# Altium schematic sheet Pallette v2.SchDoc: Pallette - Tongue Controlled Interface
size A3; Author: Joanna Zhang; Organization: Cornell Tech; Address1: 111 8th Ave #302; Address2: New York, NY; Address3: 10011; Revision: 2; SheetNumber: 1; SheetTotal: 1; ProjectName: Pallette
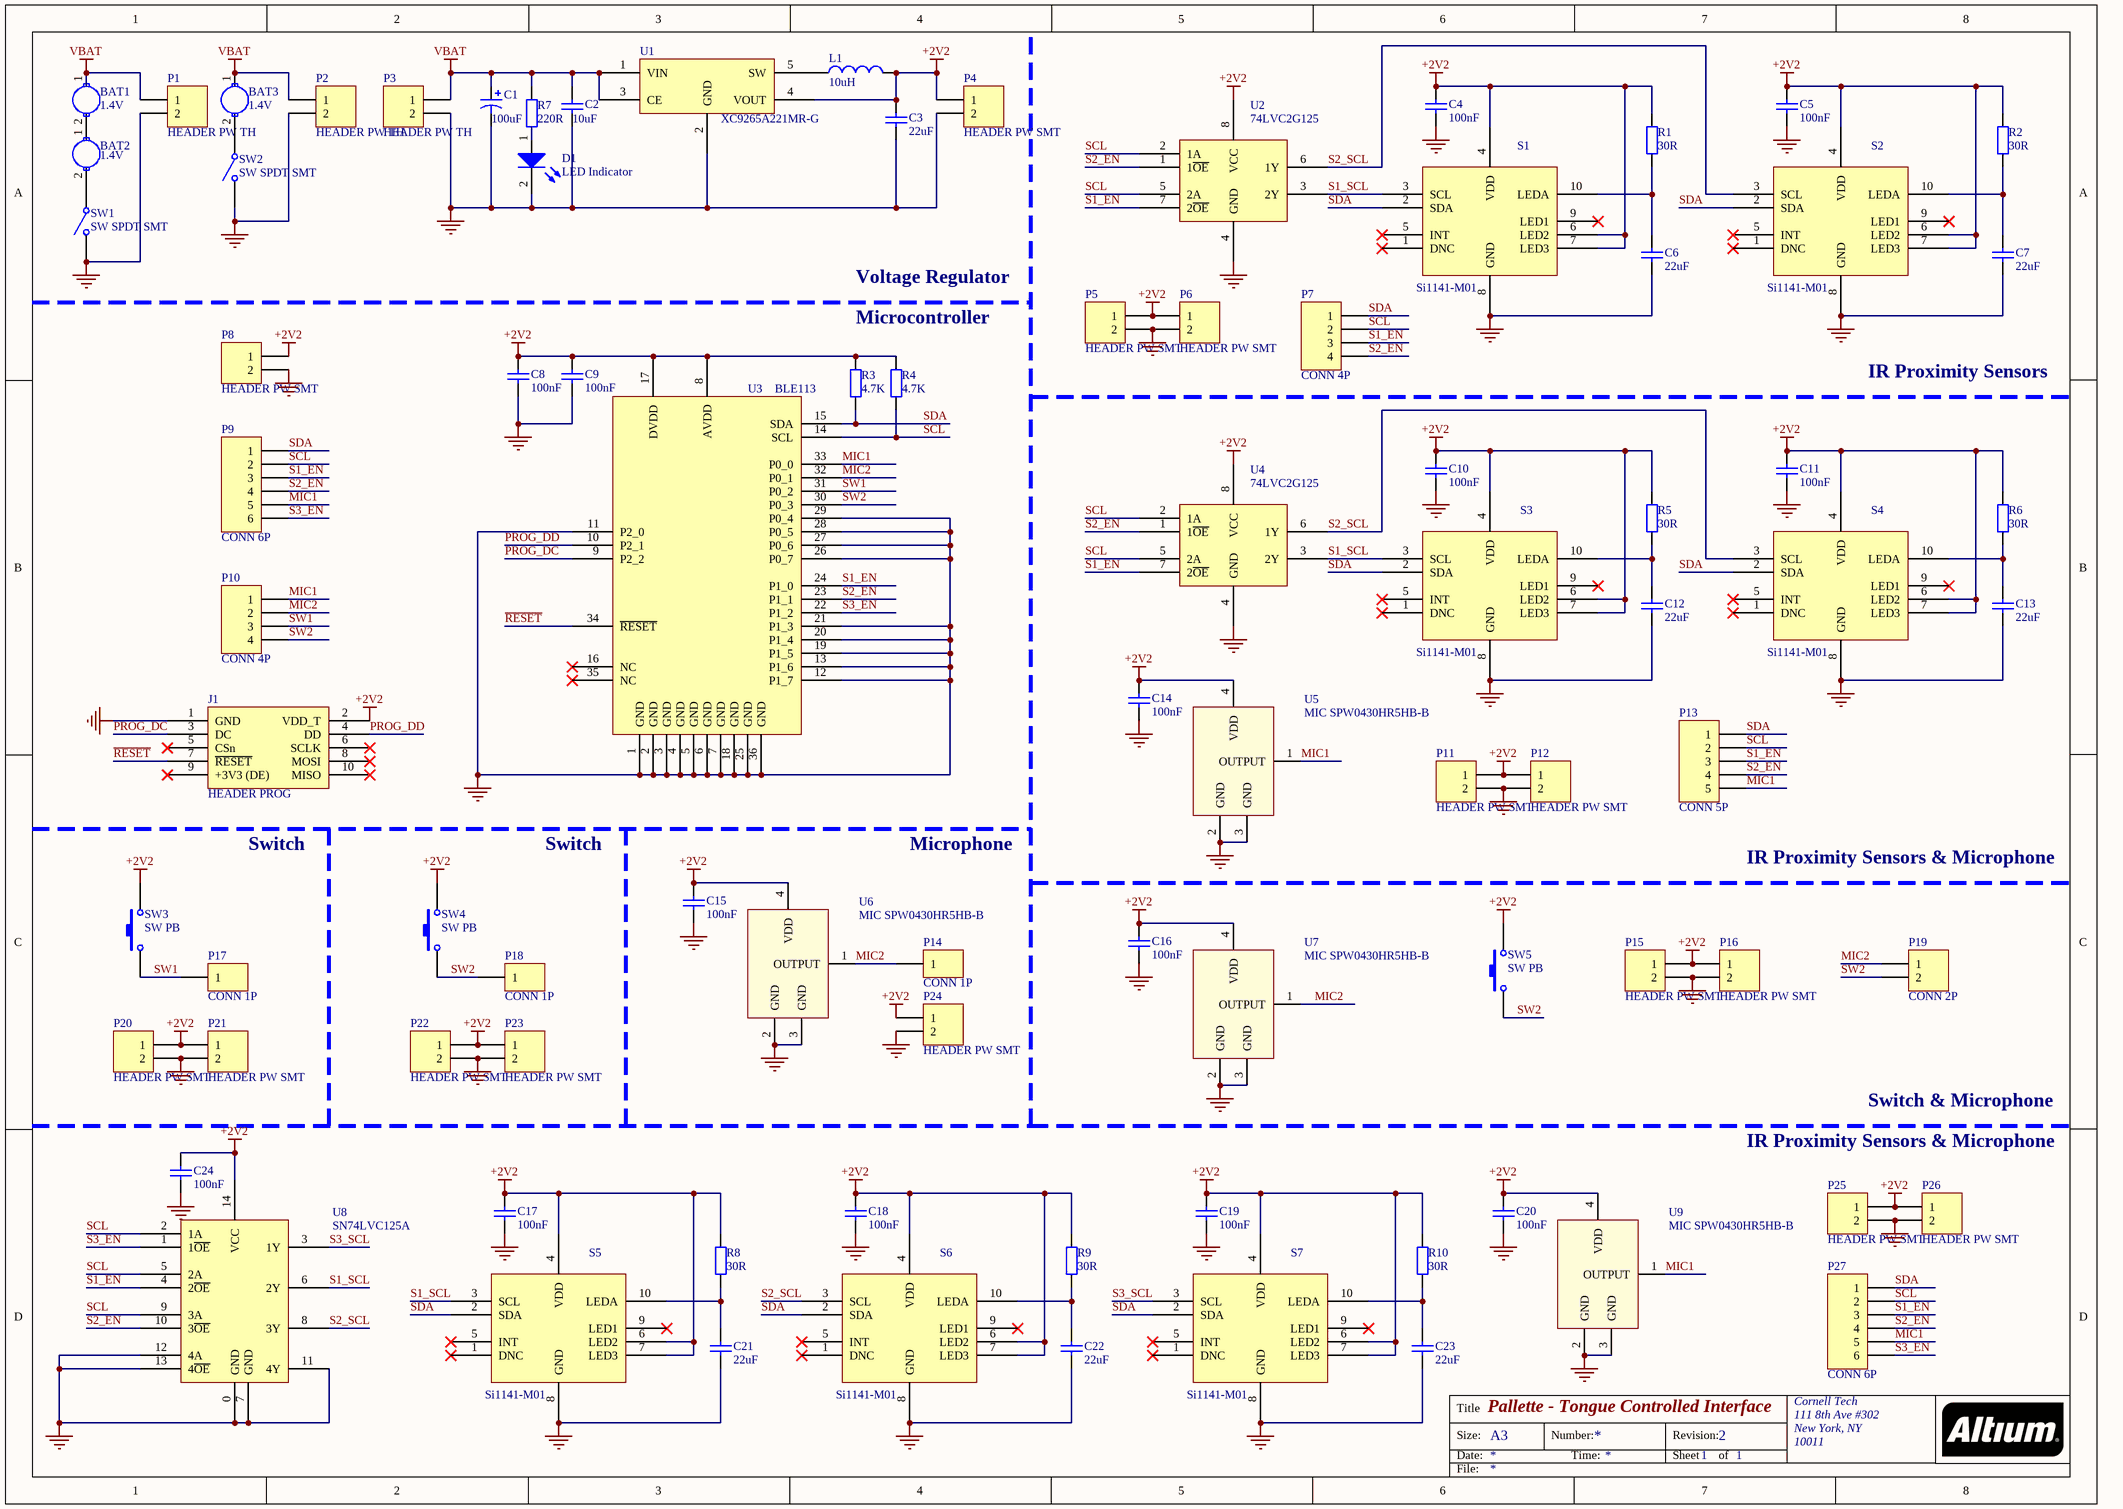
[diagram p0: Pallette v2.SchDoc]

## Parts
BAT1  value 1.4V  [BAT RETAINER 13]  (hidden comment: BAT RETAINER 13)
BAT2  value 1.4V  [BAT RETAINER 13]  (hidden comment: BAT RETAINER 13)
BAT3  value 1.4V  [BAT RETAINER 13]  (hidden comment: BAT RETAINER 13)
C1  100uF  [1411]
C2  10uF  [0603]
C3  22uF  [0603]
C4  100nF  [0402]
C5  100nF  [0402]
C6  22uF  [0603]
C7  22uF  [0603]
C8  100nF  [0402]
C9  100nF  [0402]
C10  100nF  [0402]
C11  100nF  [0402]
C12  22uF  [0603]
C13  22uF  [0603]
C14  100nF  [0402]
C15  100nF  [0402]
C16  100nF  [0402]
C17  100nF  [0402]
C18  100nF  [0402]
C19  100nF  [0402]
C20  100nF  [0402]
C21  22uF  [0603]
C22  22uF  [0603]
C23  22uF  [0603]
C24  100nF  [0402]
D1  LED Indicator  [LED]
J1  HEADER PROG  [TC2050-IDC-NL]  (no BOM)
L1  10uH  [0805]
P1  HEADER PW TH  [PORT PW TH 2P]  (no BOM)
P2  HEADER PW TH  [PORT PW TH 2P]  (no BOM)
P3  HEADER PW TH  [PORT PW TH 2P]  (no BOM)
P4  HEADER PW SMT  [PORT PW SMT 2P]  (no BOM)
P5  HEADER PW SMT  [PORT PW SMT 2P]  (no BOM)
P6  HEADER PW SMT  [PORT PW SMT 2P]  (no BOM)
P7  CONN 4P  [PORT CONN 4P]  (no BOM)
P8  HEADER PW SMT  [PORT PW SMT 2P]  (no BOM)
P9  CONN 6P  [PORT CONN 6P]  (no BOM)
P10  CONN 4P  [PORT CONN 4P]  (no BOM)
P11  HEADER PW SMT  [PORT PW SMT 2P]  (no BOM)
P12  HEADER PW SMT  [PORT PW SMT 2P]  (no BOM)
P13  CONN 5P  [PORT CONN 5P]  (no BOM)
P14  CONN 1P  [PORT CONN 1P]  (no BOM)
P15  HEADER PW SMT  [PORT PW SMT 2P]  (no BOM)
P16  HEADER PW SMT  [PORT PW SMT 2P]  (no BOM)
P17  CONN 1P  [PORT CONN 1P]  (no BOM)
P18  CONN 1P  [PORT CONN 1P]  (no BOM)
P19  CONN 2P  [PORT CONN 2P]  (no BOM)
P20  HEADER PW SMT  [PORT PW SMT 2P]  (no BOM)
P21  HEADER PW SMT  [PORT PW SMT 2P]  (no BOM)
P22  HEADER PW SMT  [PORT PW SMT 2P]  (no BOM)
P23  HEADER PW SMT  [PORT PW SMT 2P]  (no BOM)
P24  HEADER PW SMT  [PORT PW SMT 2P]  (no BOM)
P25  HEADER PW SMT  [PORT PW SMT 2P]  (no BOM)
P26  HEADER PW SMT  [PORT PW SMT 2P]  (no BOM)
P27  CONN 6P  [PORT CONN 6P]  (no BOM)
R1  30R  [0402]
R2  30R  [0402]
R3  4.7K  [0402]
R4  4.7K  [0402]
R5  30R  [0402]
R6  30R  [0402]
R7  220R  [0603]
R8  30R  [0402]
R9  30R  [0402]
R10  30R  [0402]
S1  Si1141-M01  [SI1141-M01]
S2  Si1141-M01  [SI1141-M01]
S3  Si1141-M01  [SI1141-M01]
S4  Si1141-M01  [SI1141-M01]
S5  Si1141-M01  [SI1141-M01]
S6  Si1141-M01  [SI1141-M01]
S7  Si1141-M01  [SI1141-M01]
SW1  SW SPDT SMT  [SW SPDT SMT]
SW2  SW SPDT SMT  [SW SPDT SMT]
SW3  SW PB  [SW PB]
SW4  SW PB  [SW PB]
SW5  SW PB  [SW PB]
U1  XC9265A221MR-G  [SOT-25]
U2  74LVC2G125  [VSSOP8]
U3  BLE113  [BLE113-A]
U4  74LVC2G125  [VSSOP8]
U5  MIC SPW0430HR5HB-B  [MIC-4P]
U6  MIC SPW0430HR5HB-B  [MIC-4P]
U7  MIC SPW0430HR5HB-B  [MIC-4P]
U8  SN74LVC125A  [VQFN14]
U9  MIC SPW0430HR5HB-B  [MIC-4P]

## Nets
+2V2: C3.2 C4.2 C5.2 C8.2 C9.2 C10.2 C11.2 C14.1 C15.1 C16.1 C17.2 C18.2 C19.2 C20.1 C24.2 J1.2(VDD_T) L1.2 P4.1 P5.1 P6.1 P8.1 P11.1 P12.1 P15.1 P16.1 P20.1 P21.1 P22.1 P23.1 P24.1 P25.1 P26.1 R1.2 R2.2 R3.2 R4.2 R5.2 R6.2 R8.2 R9.2 R10.2 S1.4(VDD) S1.6(LED2) S1.7(LED3) S2.4(VDD) S2.6(LED2) S2.7(LED3) S3.4(VDD) S3.6(LED2) S3.7(LED3) S4.4(VDD) S4.6(LED2) S4.7(LED3) S5.4(VDD) S5.6(LED2) S5.7(LED3) S6.4(VDD) S6.6(LED2) S6.7(LED3) S7.4(VDD) S7.6(LED2) S7.7(LED3) SW3.1 SW4.1 SW5.1 U1.4(VOUT) U2.8(VCC) U3.8(AVDD) U3.17(DVDD) U4.8(VCC) U5.4(VDD) U6.4(VDD) U7.4(VDD) U8.14(VCC) U9.4(VDD)
GND: C1.2 C2.1 C3.1 C4.1 C5.1 C6.1 C7.1 C8.1 C9.1 C10.1 C11.1 C12.1 C13.1 C14.2 C15.2 C16.2 C17.1 C18.1 C19.1 C20.2 C21.1 C22.1 C23.1 C24.1 D1.2(K) J1.1(GND) P1.2 P2.2 P3.2 P4.2 P5.2 P6.2 P8.2 P11.2 P12.2 P15.2 P16.2 P20.2 P21.2 P22.2 P23.2 P24.2 P25.2 P26.2 S1.8(GND) S2.8(GND) S3.8(GND) S4.8(GND) S5.8(GND) S6.8(GND) S7.8(GND) SW1.2(NO) SW2.2(NO) U1.2(GND) U2.4(GND) U3.1(GND) U3.2(GND) U3.3(GND) U3.4(GND) U3.5(GND) U3.6(GND) U3.7(GND) U3.11(P2_0) U3.12(P1_7) U3.13(P1_6) U3.18(GND) U3.19(P1_5) U3.20(P1_4) U3.21(P1_3) U3.25(GND) U3.26(P0_7) U3.27(P0_6) U3.28(P0_5) U3.29(P0_4) U3.36(GND) U4.4(GND) U5.2(GND) U5.3(GND) U6.2(GND) U6.3(GND) U7.2(GND) U7.3(GND) U8.0(GND) U8.7(GND) U8.11(4Y) U8.12(4A) U8.13(4~{OE}) U9.2(GND) U9.3(GND)
VBAT: BAT1.1(+) BAT3.1(+) C1.1 C2.2 P1.1 P2.1 P3.1 R7.2 U1.1(VIN) U1.3(CE)
MIC1: P9.5 P10.1 P13.5 P27.5 U3.33(P0_0) U5.1(OUTPUT) U9.1(OUTPUT)
MIC2: P10.2 P14.1 P19.1 U3.32(P0_1) U6.1(OUTPUT) U7.1(OUTPUT)
PROG_DC: J1.3(DC) U3.9(P2_2)
PROG_DD: J1.4(DD) U3.10(P2_1)
~{RESET}: J1.7(~{RESET}) U3.34(~{RESET})
S1_EN: P7.3 P9.3 P13.3 P27.3 U2.7(2~{OE}) U3.24(P1_0) U4.7(2~{OE}) U8.4(2~{OE})
S1_SCL: S1.3(SCL) S3.3(SCL) S5.3(SCL) U2.3(2Y) U4.3(2Y) U8.6(2Y)
S2_EN: P7.4 P9.4 P13.4 P27.4 U2.1(1~{OE}) U3.23(P1_1) U4.1(1~{OE}) U8.10(3~{OE})
S2_SCL: S2.3(SCL) S4.3(SCL) S6.3(SCL) U2.6(1Y) U4.6(1Y) U8.8(3Y)
S3_EN: P9.6 P27.6 U3.22(P1_2) U8.1(1~{OE})
S3_SCL: S7.3(SCL) U8.3(1Y)
SCL: P7.2 P9.2 P13.2 P27.2 R4.1 U2.2(1A) U2.5(2A) U3.14(SCL) U4.2(1A) U4.5(2A) U8.2(1A) U8.5(2A) U8.9(3A)
SDA: P7.1 P9.1 P13.1 P27.1 R3.1 S1.2(SDA) S2.2(SDA) S3.2(SDA) S4.2(SDA) S5.2(SDA) S6.2(SDA) S7.2(SDA) U3.15(SDA)
SW1: P10.3 P17.1 SW3.2 U3.31(P0_2)
SW2: P10.4 P18.1 P19.2 SW4.2 SW5.2 U3.30(P0_3)
NetBAT1_2: BAT1.2(-) BAT2.1(+)
NetBAT2_2: BAT2.2(-) SW1.1(COMMON)
NetBAT3_2: BAT3.2(-) SW2.1(COMMON)
NetC6_2: C6.2 R1.1 S1.10(LEDA)
NetC7_2: C7.2 R2.1 S2.10(LEDA)
NetC12_2: C12.2 R5.1 S3.10(LEDA)
NetC13_2: C13.2 R6.1 S4.10(LEDA)
NetC21_2: C21.2 R8.1 S5.10(LEDA)
NetC22_2: C22.2 R9.1 S6.10(LEDA)
NetC23_2: C23.2 R10.1 S7.10(LEDA)
NetD1_1: D1.1(A) R7.1
NetL1_1: L1.1 U1.5(SW)

Not connected (* = marked no-connect by the designer): J1 5(CSn)* 6(SCLK)* 8(MOSI)* 9(+3V3_(DE))* 10(MISO)*; S1 1(DNC)* 5(INT)* 9(LED1)*; S2 1(DNC)* 5(INT)* 9(LED1)*; S3 1(DNC)* 5(INT)* 9(LED1)*; S4 1(DNC)* 5(INT)* 9(LED1)*; S5 1(DNC)* 5(INT)* 9(LED1)*; S6 1(DNC)* 5(INT)* 9(LED1)*; S7 1(DNC)* 5(INT)* 9(LED1)*; U3 16(NC)* 35(NC)*

## Notes on the sheet
- Voltage Regulator
- Microcontroller
- IR Proximity Sensors
- Switch
- Microphone
- IR Proximity Sensors & Microphone
- Switch & Microphone
- Title
- Size:
- Date:
- A3
- Number:
- Time:
- Revision:
- Sheet
- of
- File:

## Library data of the parts
BAT1-BAT3 = BAT RETAINER 13: RETAINER COIN CELL SMD 7.9MM; Manufacturer: Keystone Electronics; Manufacturer Part Number: 2988; Digi-Key Part Number: 36-2988-ND
C1 = Cap Pol 100uF: CAP TANT POLY 100UF 8V 1411; Manufacturer: Panasonic Electronic Components; Manufacturer Part Number: 8TPE100MAZB; Digi-Key Part Number: P16641CT-ND; Value: 100uF
C2 = CAP 10uF: CAP CER 10UF ±20% 10V X5R 0603; Manufacturer Part Number: GRM188R61A106MAALD; Manufacturer: Murata; Digi-Key Part Number: 490-12734-1-ND; Value: 10uF
C3 C12 C21 = CAP 22uF: CAP CER 22UF 6.3V X5R 0603; Manufacturer Part Number: GRM188R60J226MEA0D; Manufacturer: Murata; Digi-Key Part Number: 490-7611-1-ND; Value: 22uF
C4 C5 C8-C11 C14-C20 C24 = Cap 100nF: CAP CER 0.1UF 10V X5R 0402; Manufacturer: Murata; Manufacturer Part Number: GRM155R61A104KA01D; Digi-Key Part Number: 490-1318-1-ND; Value: 100nF
C6 C7 C13 C22 C23 = Cap 22uF: CAP CER 22UF 6.3V X5R 0603; Manufacturer Part Number: GRM188R60J226MEA0D; Manufacturer: Murata; Digi-Key Part Number: 490-7611-1-ND; Value: 22uF
D1 = LED Indicator: LED Red 630nm 2.2V Diffused White Lens 0603; Manufacturer Part Number: SML-D12V1WT86; Manufacturer: Rohm Semiconductor; Digikey Part Number: SML-D12V1WT86CT-ND
J1 = HEADER PROG: PADS PROGRAMMING
L1 = IND 10uH: FIXED IND 10UH 500MA 320 MOHM; Manufacturer: Abracon LLC; Manufacturer Part Number: AIML-0805HC-100M-T; Digi-Key Part Number: 535-12791-1-ND; Value: 10uH
P1-P3 = HEADER PW TH: PADS POWER; LatestRevisionDate: 17-Jul-2002; LatestRevisionNote: Re-released for DXP Platform.; Publisher: Altium Limited
P4-P6 P8 P11 P12 P15 P16 P20-P26 = HEADER PW SMT: Connection Port; LatestRevisionDate: 17-Jul-2002; LatestRevisionNote: Re-released for DXP Platform.; Publisher: Altium Limited
P7 P10 = HEADER CONN 4P: Connection Port; LatestRevisionDate: 17-Jul-2002; LatestRevisionNote: Re-released for DXP Platform.; Publisher: Altium Limited
P9 P27 = HEADER CONN 6P: Connection Port; LatestRevisionDate: 17-Jul-2002; LatestRevisionNote: Re-released for DXP Platform.; Publisher: Altium Limited
P13 = HEADER CONN 5P: Connection Port
P14 P17 P18 = HEADER CONN 1P: Connection Port
P19 = HEADER CONN 2P: Connection Port; LatestRevisionDate: 17-Jul-2002; LatestRevisionNote: Re-released for DXP Platform.; Publisher: Altium Limited
R1 R2 R5 R6 R8-R10 = Res 30R: RES SMD 30 OHM 1% 1/16W 0402; Manufacturer: Yageo; Manufacturer Part Number: RC0402FR-0730RL; Digi-Key Part Number: 311-30LRCT-ND
R3 R4 = Res 4.7K: RES SMD 4.7K OHM 1% 1/16W 0402; Manufacturer: Yageo; Manufacturer Part Number: RC0402FR-074K7L; Digi-Key Part Number: 311-4.7KLRCT-ND
R7 = RES 220R: RES SMD 220 OHM 1% 1/10W 0603; Manufacturer: Panasonic; Manufacturer Part Number: ERJ-3EKF2200V; Digi-Key Part Number: P220HCT-ND
S1-S7 = Si1141-M01: SENS IR PROXIMITY AMB LT 10QFN; Manufacturer: Silicon Labs; Manufacturer Part Number: SI1141-M01-GMR; Digi-Key Part Number: 336-3260-1-ND
SW1 SW2 = SW SPDT SMT: SW Single-Pole Double-Throw SMT Right-Angle; Manufacturer: C&K Components; Manufacturer Part Number: JS202011AQN; Digikey Part Number: 401-2000-ND
SW3-SW5 = SW PB: Switch Button
U1 = VR XC9265A221MR-G: IC REG BUCK 2.2V 0.2A SYNC SOT25; Manufacturer: Torex Semiconductor Ltd; Digi-Key Part Number: 893-1305-1-ND; Manufacturer Part Number: XC9265A221MR-G
U2 U4 = BUFF 74LVC2G125: IC BUS BUFF DVR TRI-ST DL 8VSSOP; Manufacturer: NXP Semiconductors; Manufacturer Part Number: 74LVC2G125DC,125; Digi-Key Part Number: 568-7675-1-ND
U3 = uC BLE113: MODULE BT 4.0 BLE113 OTA; Manufacturer: Silicon Labs; Manufacturer Part Number: BLE113-A-M256K; Digi-Key Part Number: 1446-1035-1-ND
U5-U7 U9 = MIC SPW0430HR5HB-B: MIC MEMS ANALOG OMNI; Manufacturer: Knowles; Digi-Key Part Number: 423-1215-1-ND; Manufacturer Part Number: SPW0430HR5HB-B
U8 = BUFF SN74LVC125A: IC BUS BUFF TRI-ST QD 14VQFN; Manufacturer: Texas Instruments; Manufacturer Part Number: SN74LVC125ARGYR; Digi-Key Part Number: 296-13961-1-ND